# EAGLE design LPTSV2_usingATmega328PV6 (EAGLE 8.4.0)
AUTHOR: K. Townsend

## Sheet 1 of 3

## Sheet 2 of 3
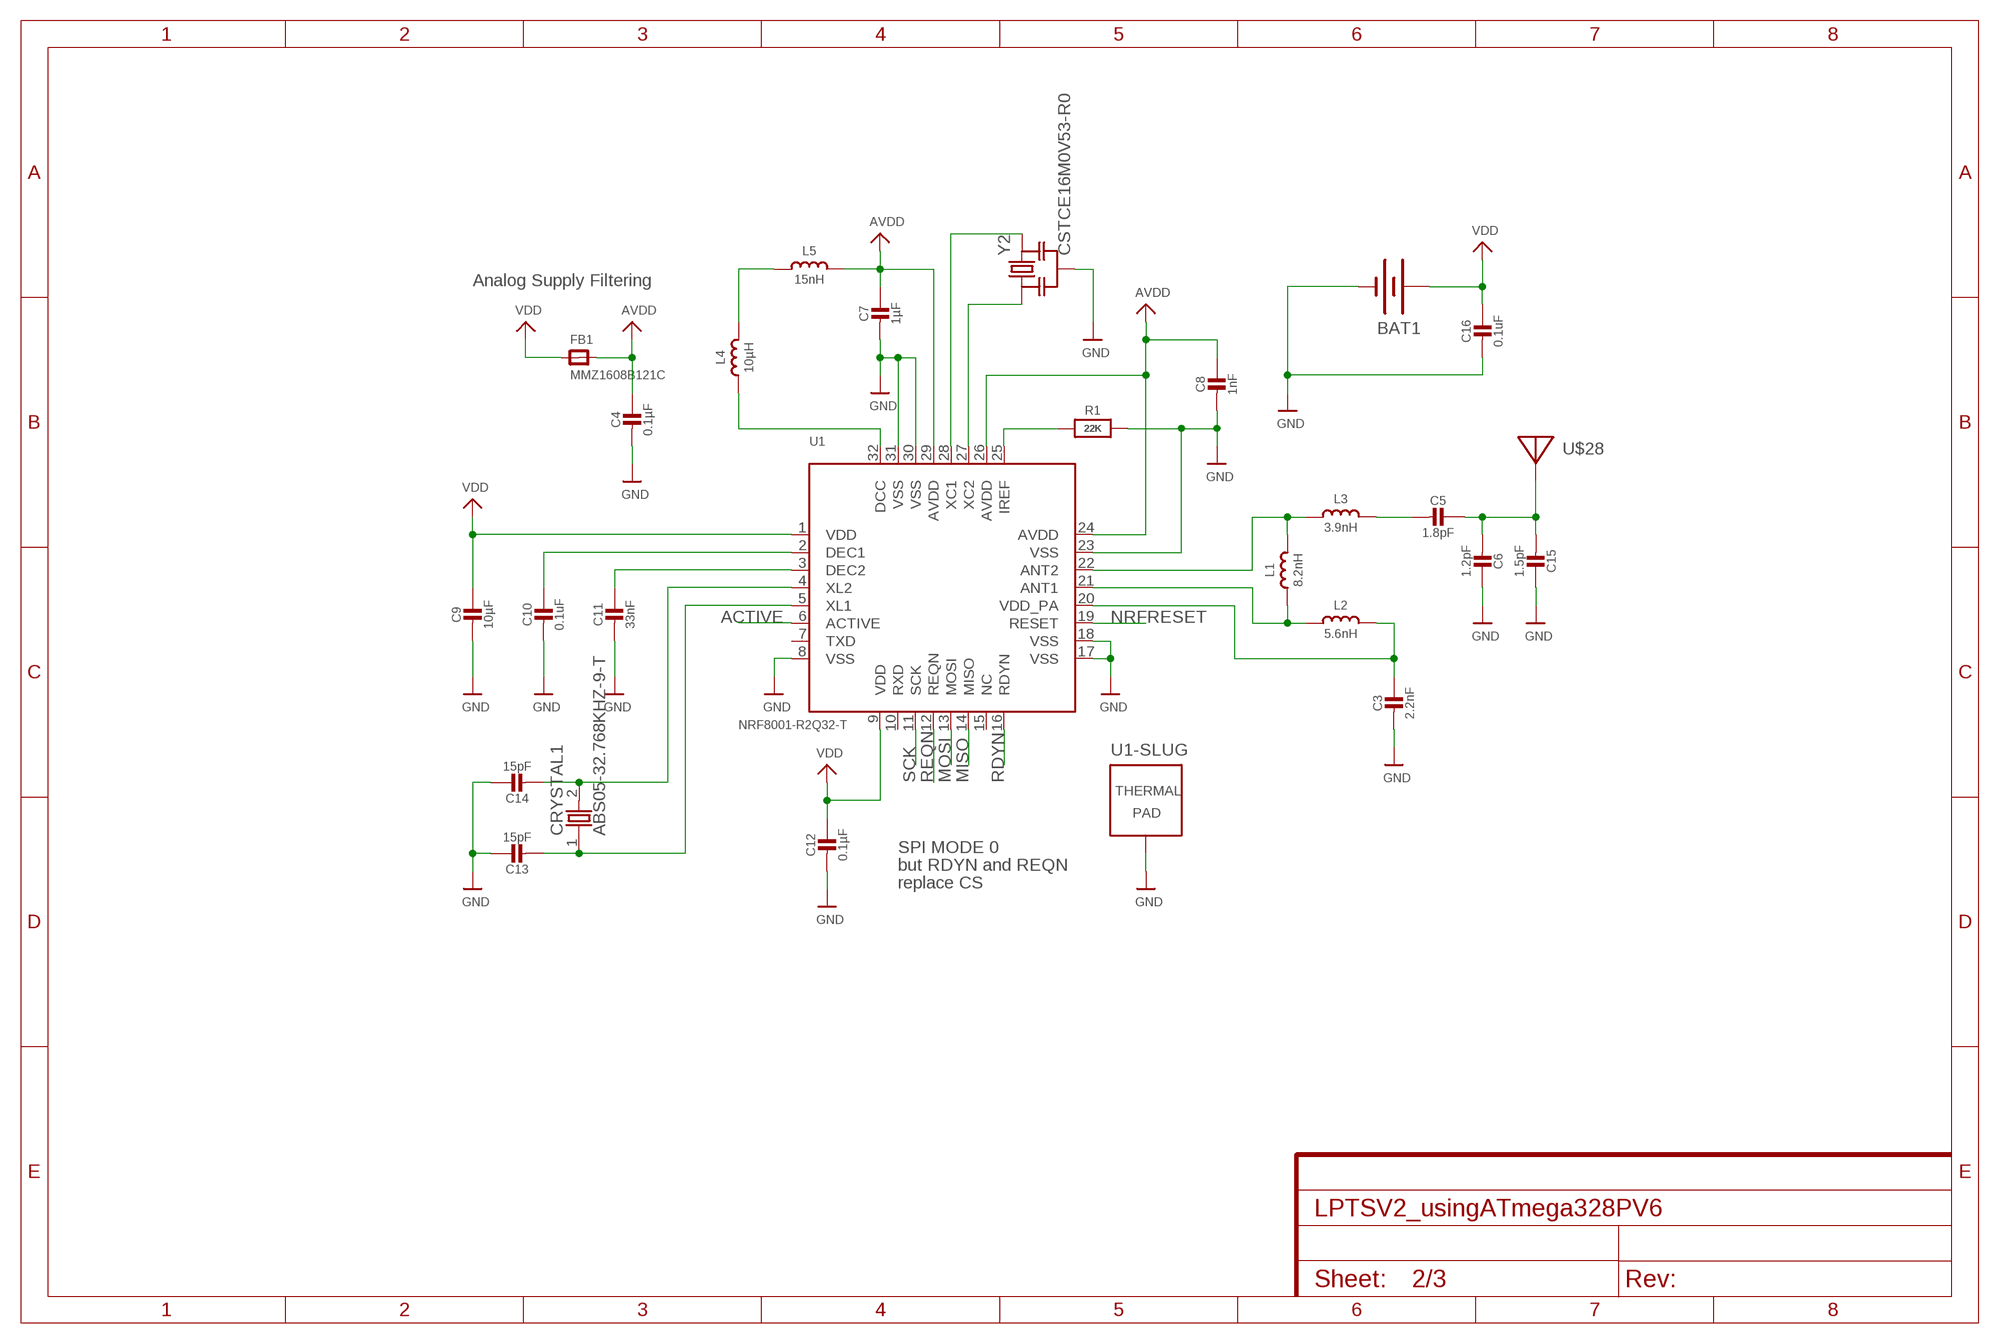
[diagram p0: schematic, sheet 2]

### Parts
BAT1  LINX-BAT-HLD-00120SMD  [BATTCON_20MM]
C3  2.2nF  CAP_CERAMIC_0402  [_0402]
C4  0.1µF  CAP_CERAMIC_0402  [_0402]
C5  1.8pF  CAP_CERAMIC_0402MP  [_0402MP]
C6  1.2pF  CAP_CERAMIC_0402MP  [_0402MP]
C7  1µF  CAP_CERAMIC_0402  [_0402]
C8  1nF  CAP_CERAMIC_0402  [_0402]
C9  10µF  CAP_CERAMIC_0402  [_0402]
C10  0.1uF  CAP_CERAMIC_0402  [_0402]
C11  33nF  CAP_CERAMIC_0402  [_0402]
C12  0.1µF  CAP_CERAMIC_0402  [_0402]
C13  15pF  CAP_CERAMIC_0402  [_0402]
C14  15pF  CAP_CERAMIC_0402  [_0402]
C15  1.5pF  CAP_CERAMIC_0402MP  [_0402MP]
C16  0.1uF  CAP_CERAMIC_0402  [_0402]
CRYSTAL1  ABS05-32.768KHZ-9-T  CRYSTAL2PIN  [CRYSTAL-2PIN]
FB1  MMZ1608B121C  FERRITE0805  [0805]
L1  8.2nH  INDUCTOR_0402  [_0402]
L2  5.6nH  INDUCTOR_0402  [_0402]
L3  3.9nH  INDUCTOR_0402  [_0402]
L4  10µH  INDUCTOR_0603  [_0603]
L5  15nH  INDUCTOR_0603  [_0603]
R1  22K  RESISTOR_0805  [_0805]
U1  NRF8001-R2Q32-T  MICROBUILDER_NRF8001  [MICROBUILDER_QFN32_5MM]
U$28  ANTENNA_PCBNRF8001_1.6MM  [ANT_PCB_2.4GHZ_NRF8001_1.6MM_1OZ]
Y2  CSTCE16M0V53-R0  RESONATOR-MURATACST_CE  [RESONATOR_MURATA2]

### Nets
ACTIVE: U1.6(ACTIVE)
AVDD: C4.1 C7.1 C8.1 FB1.2 L5.2 U1.24(AVDD) U1.26(AVDD) U1.29(AVDD)
GND: BAT1.2(-) C3.2 C4.2 C6.1 C7.2 C8.2 C9.2 C10.2 C11.2 C12.2 C13.1 C14.1 C15.1 C16.2 R1.2 U1.8(VSS) U1.17(VSS) U1.18(VSS) U1.23(VSS) U1.30(VSS) U1.31(VSS) U1.33(TP) Y2.2 ; also sheet 3
MISO: U1.14(MISO) ; also sheet 3
MOSI: U1.13(MOSI) ; also sheet 3
N$2: L1.2 L3.1 U1.22(ANT2)
N$3: L1.1 L2.1 U1.21(ANT1)
N$4: C3.1 L2.2 U1.20(VDD_PA)
N$5: L4.2 L5.1
N$6: C5.2 L3.2
N$7: C11.1 U1.3(DEC2)
N$8: C10.1 U1.2(DEC1)
N$9: U1.28(XC1) Y2.3
N$10: U1.27(XC2) Y2.1
N$11: L4.1 U1.32(DCC)
N$12: R1.1 U1.25(IREF)
N$13: C5.1 C6.2 C15.2 U$28.FEED
N$22: C14.2 CRYSTAL1.2 U1.4(XL2)
N$23: C13.2 CRYSTAL1.1 U1.5(XL1)
NRFRESET: U1.19(RESET) ; also sheet 3
RDYN: U1.16(RDYN) ; also sheet 3
REQN: U1.12(REQN) ; also sheet 3
SCK: U1.11(SCK) ; also sheet 3
VDD: BAT1.1(+) BAT1.3(+) C9.1 C12.1 C16.1 FB1.1 U1.1(VDD) U1.9(VDD) ; also sheet 3
Unconnected: U1.7(TXD) U1.10(RXD) U1.15(NC)

### Notes on the sheet
- Analog Supply Filtering
- SPI MODE 0
- but RDYN and REQN
- replace CS

## Sheet 3 of 3
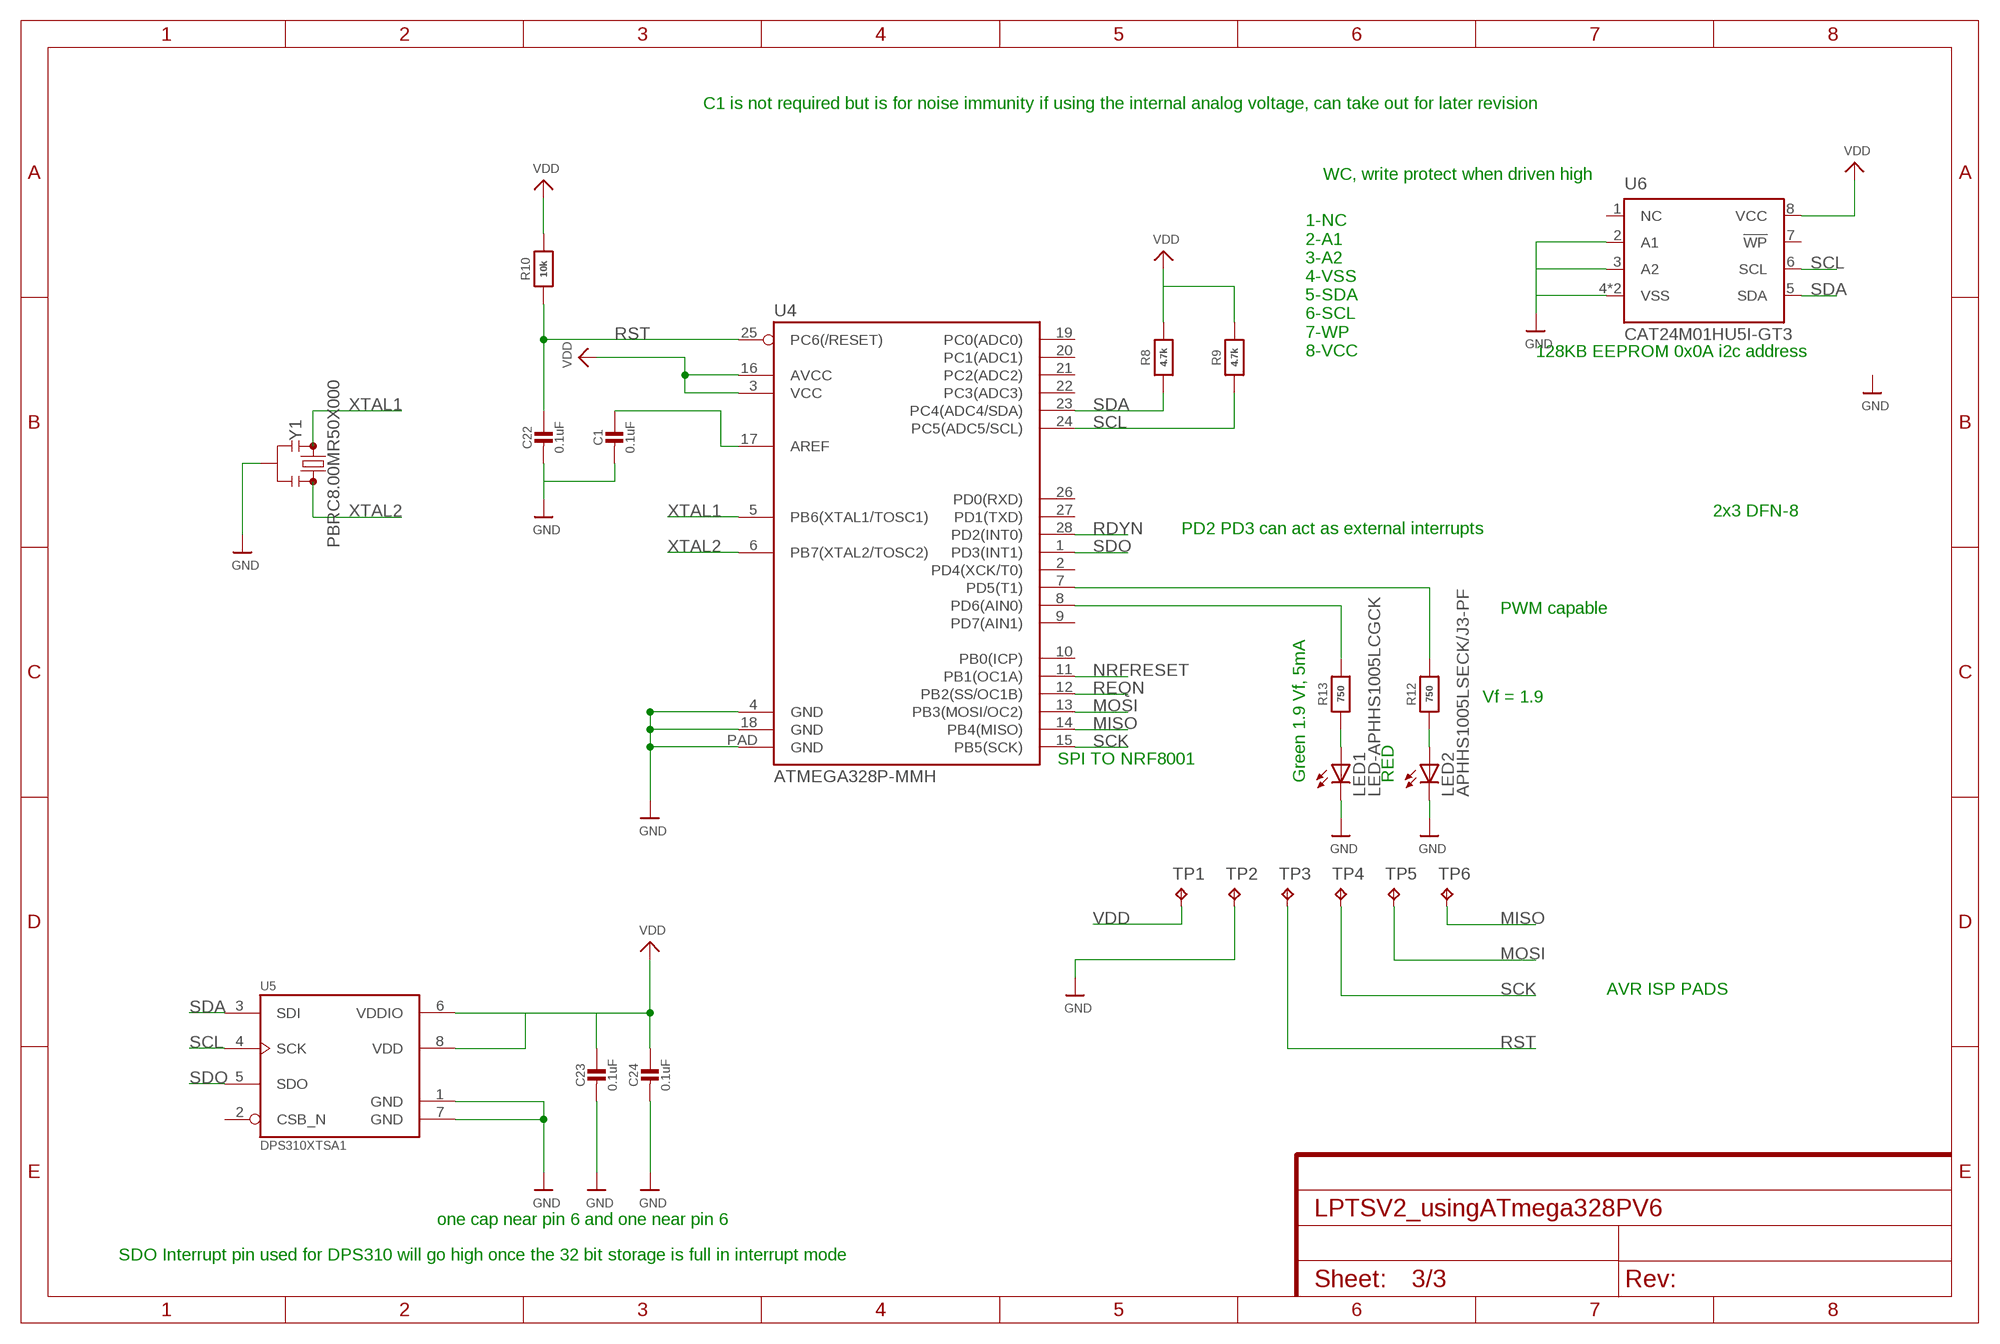
[diagram p1: schematic, sheet 3]

### Parts
C1  0.1uF  CAP_CERAMIC_0402  [_0402]
C22  0.1uF  CAP_CERAMIC_0402  [_0402]
C23  0.1uF  CAP_CERAMIC_0402  [_0402]
C24  0.1uF  CAP_CERAMIC_0402  [_0402]
LED1  LED-APHHS1005LCGCK  LED-0402  [0402-LED]
LED2  APHHS1005LSECK/J3-PF  LED-0402  [0402-LED]
R8  4.7k  RESISTOR_0402  [_0402]
R9  4.7k  RESISTOR_0402  [_0402]
R10  10k  RESISTOR_0402  [_0402]
R12  750  RESISTOR_0402  [_0402]
R13  750  RESISTOR_0402  [_0402]
TP1  TPTP10SQ  [TP10SQ]
TP2  TPTP10SQ  [TP10SQ]
TP3  TPTP10SQ  [TP10SQ]
TP4  TPTP10SQ  [TP10SQ]
TP5  TPTP10SQ  [TP10SQ]
TP6  TPTP10SQ  [TP10SQ]
U4  ATMEGA328P-MMH  SPARKFUN-IC-MICROCONTROLLER_ATMEGA328P_VQFNVQFN  [SPARKFUN-IC-MICROCONTROLLER_VQFN-28]
U5  DPS310XTSA1  DPS310  [LGA8S145X65P2X4_200X250X100]
U6  CAT24M01HU5I-GT3  [DFN-2X3]
Y1  PBRC8.00MR50X000  RESONATOR-4MHZSMD-4.5X2  [RESONATOR-SMD-4.5X2.0]

### Nets
GND: C1.2 C22.2 C23.2 C24.2 LED1.C LED2.C TP2.TP U4.4(GND) U4.18(GND) U4.PAD(GND) U5.1(GND) U5.7(GND) U6.2(A1) U6.3(A2) U6.4(VSS) U6.EXP(VSS) Y1.2 ; also sheet 2
MISO: TP6.TP U4.14(PB4(MISO)) ; also sheet 2
MOSI: TP5.TP U4.13(PB3(MOSI/OC2)) ; also sheet 2
N$1: R12.2 U4.7(PD5(T1))
N$14: R13.2 U4.8(PD6(AIN0))
N$15: LED1.A R13.1
N$16: LED2.A R12.1
N$18: C1.1 U4.17(AREF)
NRFRESET: U4.11(PB1(OC1A)) ; also sheet 2
RDYN: U4.28(PD2(INT0)) ; also sheet 2
REQN: U4.12(PB2(SS/OC1B)) ; also sheet 2
RST: C22.1 R10.1 TP3.TP U4.25(PC6(/RESET))
SCK: TP4.TP U4.15(PB5(SCK)) ; also sheet 2
SCL: R9.1 U4.24(PC5(ADC5/SCL)) U5.4(SCK) U6.6(SCL)
SDA: R8.1 U4.23(PC4(ADC4/SDA)) U5.3(SDI) U6.5(SDA)
SDO: U4.1(PD3(INT1)) U5.5(SDO)
VDD: C23.1 C24.1 R8.2 R9.2 R10.2 TP1.TP U4.3(VCC) U4.16(AVCC) U5.6(VDDIO) U5.8(VDD) U6.8(VCC) ; also sheet 2
XTAL1: U4.5(PB6(XTAL1/TOSC1)) Y1.1
XTAL2: U4.6(PB7(XTAL2/TOSC2)) Y1.3
Unconnected: U4.2(PD4(XCK/T0)) U4.9(PD7(AIN1)) U4.10(PB0(ICP)) U4.19(PC0(ADC0)) U4.20(PC1(ADC1)) U4.21(PC2(ADC2)) U4.22(PC3(ADC3)) U4.26(PD0(RXD)) U4.27(PD1(TXD)) U5.2(CSB_N) U6.1(NC) U6.7(!WP)

### Notes on the sheet
- C1 is not required but is for noise immunity if using the internal analog voltage, can take out for later revision
- WC, write protect when driven high
- 128KB EEPROM 0x0A i2c address
- 1-NC
  2-A1
  3-A2
  4-VSS
  5-SDA
  6-SCL
  7-WP
  8-VCC
- 2x3 DFN-8
- PD2 PD3 can act as external interrupts
- PWM capable
- Vf = 1.9
- SPI TO NRF8001
- Green 1.9 Vf, 5mA | RED
- AVR ISP PADS
- one cap near pin 6 and one near pin 6
- SDO Interrupt pin used for DPS310 will go high once the 32 bit storage is full in interrupt mode

## Library data of the parts
BAT1 = battery (1):LINX-BAT-HLD-001: Battery Holders Linxtechnologies CR2032 battery holder: http://www.linxtechnologies.com/resources/diagrams/bat-hld-001.pdf; PARTNUMBER: BAT-HLD-001-TRCT-ND
C1 C4 C10 C12 C16 C22-C24 = microbuilder:CAP_CERAMIC: Ceramic Capacitors For new designs, use the packages preceded by an '_' character since they are more reliable: The following footprints should be used on most boards: _0402 - Standard footprint for regular board layouts _0603 - Standard footprint for regular board layouts _0805 - Standard footprint for regular board layouts _1206 - Standard footprint for regular board layouts For extremely tight-pitch boards where space is at a premium, the following 'micro-pitch' footprints can be used (smaller pads, no silkscreen outline, etc.): _0402MP - Micro-pitch footprint for very dense/compact boards _0603MP - Micro-pitch footprint for very dense/compact boards _0805MP - Micro-pitch footprint for very dense/compact boards _1206MP - Micro-pitch footprint for very dense/compact boards; PARTNUMBER: GRM155R71C104KA88J
C3 = microbuilder:CAP_CERAMIC: Ceramic Capacitors For new designs, use the packages preceded by an '_' character since they are more reliable: The following footprints should be used on most boards: _0402 - Standard footprint for regular board layouts _0603 - Standard footprint for regular board layouts _0805 - Standard footprint for regular board layouts _1206 - Standard footprint for regular board layouts For extremely tight-pitch boards where space is at a premium, the following 'micro-pitch' footprints can be used (smaller pads, no silkscreen outline, etc.): _0402MP - Micro-pitch footprint for very dense/compact boards _0603MP - Micro-pitch footprint for very dense/compact boards _0805MP - Micro-pitch footprint for very dense/compact boards _1206MP - Micro-pitch footprint for very dense/compact boards; PARTNUMBER: C0402C222J8JAC7867
C5 = microbuilder:CAP_CERAMIC: Ceramic Capacitors For new designs, use the packages preceded by an '_' character since they are more reliable: The following footprints should be used on most boards: _0402 - Standard footprint for regular board layouts _0603 - Standard footprint for regular board layouts _0805 - Standard footprint for regular board layouts _1206 - Standard footprint for regular board layouts For extremely tight-pitch boards where space is at a premium, the following 'micro-pitch' footprints can be used (smaller pads, no silkscreen outline, etc.): _0402MP - Micro-pitch footprint for very dense/compact boards _0603MP - Micro-pitch footprint for very dense/compact boards _0805MP - Micro-pitch footprint for very dense/compact boards _1206MP - Micro-pitch footprint for very dense/compact boards; PARTNUMBER: GRM1555C1E1R8BA01D
C6 = microbuilder:CAP_CERAMIC: Ceramic Capacitors For new designs, use the packages preceded by an '_' character since they are more reliable: The following footprints should be used on most boards: _0402 - Standard footprint for regular board layouts _0603 - Standard footprint for regular board layouts _0805 - Standard footprint for regular board layouts _1206 - Standard footprint for regular board layouts For extremely tight-pitch boards where space is at a premium, the following 'micro-pitch' footprints can be used (smaller pads, no silkscreen outline, etc.): _0402MP - Micro-pitch footprint for very dense/compact boards _0603MP - Micro-pitch footprint for very dense/compact boards _0805MP - Micro-pitch footprint for very dense/compact boards _1206MP - Micro-pitch footprint for very dense/compact boards; PARTNUMBER: GRM1555C1E1R2BA01D
C7 = microbuilder:CAP_CERAMIC: Ceramic Capacitors For new designs, use the packages preceded by an '_' character since they are more reliable: The following footprints should be used on most boards: _0402 - Standard footprint for regular board layouts _0603 - Standard footprint for regular board layouts _0805 - Standard footprint for regular board layouts _1206 - Standard footprint for regular board layouts For extremely tight-pitch boards where space is at a premium, the following 'micro-pitch' footprints can be used (smaller pads, no silkscreen outline, etc.): _0402MP - Micro-pitch footprint for very dense/compact boards _0603MP - Micro-pitch footprint for very dense/compact boards _0805MP - Micro-pitch footprint for very dense/compact boards _1206MP - Micro-pitch footprint for very dense/compact boards; PARTNUMBER: 0402ZD105KAT2A
C8 = microbuilder:CAP_CERAMIC: Ceramic Capacitors For new designs, use the packages preceded by an '_' character since they are more reliable: The following footprints should be used on most boards: _0402 - Standard footprint for regular board layouts _0603 - Standard footprint for regular board layouts _0805 - Standard footprint for regular board layouts _1206 - Standard footprint for regular board layouts For extremely tight-pitch boards where space is at a premium, the following 'micro-pitch' footprints can be used (smaller pads, no silkscreen outline, etc.): _0402MP - Micro-pitch footprint for very dense/compact boards _0603MP - Micro-pitch footprint for very dense/compact boards _0805MP - Micro-pitch footprint for very dense/compact boards _1206MP - Micro-pitch footprint for very dense/compact boards; PARTNUMBER: GRM155R71H102KA01D
C9 = microbuilder:CAP_CERAMIC: Ceramic Capacitors For new designs, use the packages preceded by an '_' character since they are more reliable: The following footprints should be used on most boards: _0402 - Standard footprint for regular board layouts _0603 - Standard footprint for regular board layouts _0805 - Standard footprint for regular board layouts _1206 - Standard footprint for regular board layouts For extremely tight-pitch boards where space is at a premium, the following 'micro-pitch' footprints can be used (smaller pads, no silkscreen outline, etc.): _0402MP - Micro-pitch footprint for very dense/compact boards _0603MP - Micro-pitch footprint for very dense/compact boards _0805MP - Micro-pitch footprint for very dense/compact boards _1206MP - Micro-pitch footprint for very dense/compact boards; PARTNUMBER: GRM155R60J106ME15D
C11 = microbuilder:CAP_CERAMIC: Ceramic Capacitors For new designs, use the packages preceded by an '_' character since they are more reliable: The following footprints should be used on most boards: _0402 - Standard footprint for regular board layouts _0603 - Standard footprint for regular board layouts _0805 - Standard footprint for regular board layouts _1206 - Standard footprint for regular board layouts For extremely tight-pitch boards where space is at a premium, the following 'micro-pitch' footprints can be used (smaller pads, no silkscreen outline, etc.): _0402MP - Micro-pitch footprint for very dense/compact boards _0603MP - Micro-pitch footprint for very dense/compact boards _0805MP - Micro-pitch footprint for very dense/compact boards _1206MP - Micro-pitch footprint for very dense/compact boards; PARTNUMBER: C0402C333K8RACTU
C13 C14 = microbuilder:CAP_CERAMIC: Ceramic Capacitors For new designs, use the packages preceded by an '_' character since they are more reliable: The following footprints should be used on most boards: _0402 - Standard footprint for regular board layouts _0603 - Standard footprint for regular board layouts _0805 - Standard footprint for regular board layouts _1206 - Standard footprint for regular board layouts For extremely tight-pitch boards where space is at a premium, the following 'micro-pitch' footprints can be used (smaller pads, no silkscreen outline, etc.): _0402MP - Micro-pitch footprint for very dense/compact boards _0603MP - Micro-pitch footprint for very dense/compact boards _0805MP - Micro-pitch footprint for very dense/compact boards _1206MP - Micro-pitch footprint for very dense/compact boards; PARTNUMBER: GRM1555C1H150JA01D
C15 = microbuilder:CAP_CERAMIC: Ceramic Capacitors For new designs, use the packages preceded by an '_' character since they are more reliable: The following footprints should be used on most boards: _0402 - Standard footprint for regular board layouts _0603 - Standard footprint for regular board layouts _0805 - Standard footprint for regular board layouts _1206 - Standard footprint for regular board layouts For extremely tight-pitch boards where space is at a premium, the following 'micro-pitch' footprints can be used (smaller pads, no silkscreen outline, etc.): _0402MP - Micro-pitch footprint for very dense/compact boards _0603MP - Micro-pitch footprint for very dense/compact boards _0805MP - Micro-pitch footprint for very dense/compact boards _1206MP - Micro-pitch footprint for very dense/compact boards; PARTNUMBER: GRM1555C1H1R5BA01D
CRYSTAL1 = Crystal-ABS05-32.768KHZ-9-T:CRYSTAL: SMD LOW PROFILE CRYSTAL 1.6 x 1.0 x 0.5mm http://www.digikey.com/product-detail/en/ABS05-32.768KHZ-9-T/535-11897-1-ND/35080692
FB1 = microbuilder:FERRITE: Ferrite Bead 0603 MMZ1608B121C - 120 Ohm @ 100MHz, 600mA, 0.15 Ohm DC Resistance - Digikey: 445-2164-1-ND BK1608HW121-T - 120 Ohm, 600mA Ferrite Chip - Digikey: 587-1876-2-ND 0805 HZ0805B272R-10 - 2.7K Ohm @ 100MHz, 200mA, 0.8 Ohm DC Resistance - Digikey: 240-2504-1-ND (see also Murata BLM21BD272SN1L) MMZ2012Y152B - 1.5K Ohm @ 100MHz, 500mA, 0.4 Ohm DC Resistance - Digikey: 445-1560-1-ND - Mainly for high frequency (80-400MHz) MMZ2012R102A - 1K Ohm @ 100MHz, 500mA, 0.3 Ohm DC Resistance - Digikey: 445-1555-2-ND - More general purpose (10-200MHz); PARTNUMBER: MMZ1608B121CTDH5
L1 = microbuilder:INDUCTOR: Inductors 0603: 10nH Ceramic Inductor - microwire antenna/RF (Digikey: 712-1434-2-ND) 0805: 560nH Ceramic Inductor - RF (Digikey: 553-1047-1-ND) 270nH Ceramic Inductor - Q = 40@250MHz, +-5%, 1 Ohm DC Resistance (Digikey: 535-10506-2-ND) 1007 (2518 Metric) SMT: 10µH 10% 250mOhm 820mA 1007 Inductor (Digikey: 587-2189-1-ND) 22µH 10% 500mOhm 580mA 1007 Inductor (Digikey: 587-2190-1-ND) 47µH 10% 950mOhm 420mA 1007 Inductor (Digikey: 587-2191-1-ND) 47µH 5% 100mOhm 1A 1008 Inductor (Digikey: 732-1816-1-ND) 5.0x5.0mm (Taiyo Yuden NR5040 Series) 6.8µH 20% 2.3A 64mOhm Inductor (Digikey: 587-2374-2-ND) 5.0x5.0mm (TDK VLC5045 Series) 4.7µH 20% 3.3A 34mOhm Inductor (Digikey: 445-6526-1-ND) 6.8µH 20% 2.7A 46mOhm Inductor (Digikey: 445-6527-1-ND) 6.0x6.0mm (TDK VLC6045 Series) 4.7µH 20% 3.8A 27mOhm Inductor (Digikey: 445-6538-2-ND) 6.8µH 20% 3A 41mOhm Inductor (Digikey: 445-6540-1-ND) 6.2µH 30% 2.2A 45mOhm Inductor (Digikey: SRR5028-6R2YCT-ND) - Not TDK VLC6045 but footprint should match 6.0x6.0mm (TDK SLF6045 Series) 6.8uH 30% 2A 33mOhm Inductor (Digikey: 445-4572-1-ND, Mouser: 810-SLF645T6R8N2R0PF) 6.0x6.0mm (Sumida CDRH5D28 Series) 6.2uH 30% 1.8A 45mOhm Inductor (Digikey: 308-1542-1-ND) Taiyo Yuden NR3015T2R2M - 2.2uH 20% 1.5A (Digikey: 587-1648-2-ND, Mouser: 963-NR3015T2R2M) - Used with TI TPS62172 CoilCraft RFID Transponder Coil - MA5532-AE (For use with AS3935 Lightning Sensor); PARTNUMBER: LQP15MN8N2B02D
L2 = microbuilder:INDUCTOR: Inductors 0603: 10nH Ceramic Inductor - microwire antenna/RF (Digikey: 712-1434-2-ND) 0805: 560nH Ceramic Inductor - RF (Digikey: 553-1047-1-ND) 270nH Ceramic Inductor - Q = 40@250MHz, +-5%, 1 Ohm DC Resistance (Digikey: 535-10506-2-ND) 1007 (2518 Metric) SMT: 10µH 10% 250mOhm 820mA 1007 Inductor (Digikey: 587-2189-1-ND) 22µH 10% 500mOhm 580mA 1007 Inductor (Digikey: 587-2190-1-ND) 47µH 10% 950mOhm 420mA 1007 Inductor (Digikey: 587-2191-1-ND) 47µH 5% 100mOhm 1A 1008 Inductor (Digikey: 732-1816-1-ND) 5.0x5.0mm (Taiyo Yuden NR5040 Series) 6.8µH 20% 2.3A 64mOhm Inductor (Digikey: 587-2374-2-ND) 5.0x5.0mm (TDK VLC5045 Series) 4.7µH 20% 3.3A 34mOhm Inductor (Digikey: 445-6526-1-ND) 6.8µH 20% 2.7A 46mOhm Inductor (Digikey: 445-6527-1-ND) 6.0x6.0mm (TDK VLC6045 Series) 4.7µH 20% 3.8A 27mOhm Inductor (Digikey: 445-6538-2-ND) 6.8µH 20% 3A 41mOhm Inductor (Digikey: 445-6540-1-ND) 6.2µH 30% 2.2A 45mOhm Inductor (Digikey: SRR5028-6R2YCT-ND) - Not TDK VLC6045 but footprint should match 6.0x6.0mm (TDK SLF6045 Series) 6.8uH 30% 2A 33mOhm Inductor (Digikey: 445-4572-1-ND, Mouser: 810-SLF645T6R8N2R0PF) 6.0x6.0mm (Sumida CDRH5D28 Series) 6.2uH 30% 1.8A 45mOhm Inductor (Digikey: 308-1542-1-ND) Taiyo Yuden NR3015T2R2M - 2.2uH 20% 1.5A (Digikey: 587-1648-2-ND, Mouser: 963-NR3015T2R2M) - Used with TI TPS62172 CoilCraft RFID Transponder Coil - MA5532-AE (For use with AS3935 Lightning Sensor); PARTNUMBER: LQP15MN5N6B02D
L3 = microbuilder:INDUCTOR: Inductors 0603: 10nH Ceramic Inductor - microwire antenna/RF (Digikey: 712-1434-2-ND) 0805: 560nH Ceramic Inductor - RF (Digikey: 553-1047-1-ND) 270nH Ceramic Inductor - Q = 40@250MHz, +-5%, 1 Ohm DC Resistance (Digikey: 535-10506-2-ND) 1007 (2518 Metric) SMT: 10µH 10% 250mOhm 820mA 1007 Inductor (Digikey: 587-2189-1-ND) 22µH 10% 500mOhm 580mA 1007 Inductor (Digikey: 587-2190-1-ND) 47µH 10% 950mOhm 420mA 1007 Inductor (Digikey: 587-2191-1-ND) 47µH 5% 100mOhm 1A 1008 Inductor (Digikey: 732-1816-1-ND) 5.0x5.0mm (Taiyo Yuden NR5040 Series) 6.8µH 20% 2.3A 64mOhm Inductor (Digikey: 587-2374-2-ND) 5.0x5.0mm (TDK VLC5045 Series) 4.7µH 20% 3.3A 34mOhm Inductor (Digikey: 445-6526-1-ND) 6.8µH 20% 2.7A 46mOhm Inductor (Digikey: 445-6527-1-ND) 6.0x6.0mm (TDK VLC6045 Series) 4.7µH 20% 3.8A 27mOhm Inductor (Digikey: 445-6538-2-ND) 6.8µH 20% 3A 41mOhm Inductor (Digikey: 445-6540-1-ND) 6.2µH 30% 2.2A 45mOhm Inductor (Digikey: SRR5028-6R2YCT-ND) - Not TDK VLC6045 but footprint should match 6.0x6.0mm (TDK SLF6045 Series) 6.8uH 30% 2A 33mOhm Inductor (Digikey: 445-4572-1-ND, Mouser: 810-SLF645T6R8N2R0PF) 6.0x6.0mm (Sumida CDRH5D28 Series) 6.2uH 30% 1.8A 45mOhm Inductor (Digikey: 308-1542-1-ND) Taiyo Yuden NR3015T2R2M - 2.2uH 20% 1.5A (Digikey: 587-1648-2-ND, Mouser: 963-NR3015T2R2M) - Used with TI TPS62172 CoilCraft RFID Transponder Coil - MA5532-AE (For use with AS3935 Lightning Sensor); PARTNUMBER: LQP03TN3N9B02D
L4 = microbuilder:INDUCTOR: Inductors 0603: 10nH Ceramic Inductor - microwire antenna/RF (Digikey: 712-1434-2-ND) 0805: 560nH Ceramic Inductor - RF (Digikey: 553-1047-1-ND) 270nH Ceramic Inductor - Q = 40@250MHz, +-5%, 1 Ohm DC Resistance (Digikey: 535-10506-2-ND) 1007 (2518 Metric) SMT: 10µH 10% 250mOhm 820mA 1007 Inductor (Digikey: 587-2189-1-ND) 22µH 10% 500mOhm 580mA 1007 Inductor (Digikey: 587-2190-1-ND) 47µH 10% 950mOhm 420mA 1007 Inductor (Digikey: 587-2191-1-ND) 47µH 5% 100mOhm 1A 1008 Inductor (Digikey: 732-1816-1-ND) 5.0x5.0mm (Taiyo Yuden NR5040 Series) 6.8µH 20% 2.3A 64mOhm Inductor (Digikey: 587-2374-2-ND) 5.0x5.0mm (TDK VLC5045 Series) 4.7µH 20% 3.3A 34mOhm Inductor (Digikey: 445-6526-1-ND) 6.8µH 20% 2.7A 46mOhm Inductor (Digikey: 445-6527-1-ND) 6.0x6.0mm (TDK VLC6045 Series) 4.7µH 20% 3.8A 27mOhm Inductor (Digikey: 445-6538-2-ND) 6.8µH 20% 3A 41mOhm Inductor (Digikey: 445-6540-1-ND) 6.2µH 30% 2.2A 45mOhm Inductor (Digikey: SRR5028-6R2YCT-ND) - Not TDK VLC6045 but footprint should match 6.0x6.0mm (TDK SLF6045 Series) 6.8uH 30% 2A 33mOhm Inductor (Digikey: 445-4572-1-ND, Mouser: 810-SLF645T6R8N2R0PF) 6.0x6.0mm (Sumida CDRH5D28 Series) 6.2uH 30% 1.8A 45mOhm Inductor (Digikey: 308-1542-1-ND) Taiyo Yuden NR3015T2R2M - 2.2uH 20% 1.5A (Digikey: 587-1648-2-ND, Mouser: 963-NR3015T2R2M) - Used with TI TPS62172 CoilCraft RFID Transponder Coil - MA5532-AE (For use with AS3935 Lightning Sensor); PARTNUMBER: LBMF1608T100K
L5 = microbuilder:INDUCTOR: Inductors 0603: 10nH Ceramic Inductor - microwire antenna/RF (Digikey: 712-1434-2-ND) 0805: 560nH Ceramic Inductor - RF (Digikey: 553-1047-1-ND) 270nH Ceramic Inductor - Q = 40@250MHz, +-5%, 1 Ohm DC Resistance (Digikey: 535-10506-2-ND) 1007 (2518 Metric) SMT: 10µH 10% 250mOhm 820mA 1007 Inductor (Digikey: 587-2189-1-ND) 22µH 10% 500mOhm 580mA 1007 Inductor (Digikey: 587-2190-1-ND) 47µH 10% 950mOhm 420mA 1007 Inductor (Digikey: 587-2191-1-ND) 47µH 5% 100mOhm 1A 1008 Inductor (Digikey: 732-1816-1-ND) 5.0x5.0mm (Taiyo Yuden NR5040 Series) 6.8µH 20% 2.3A 64mOhm Inductor (Digikey: 587-2374-2-ND) 5.0x5.0mm (TDK VLC5045 Series) 4.7µH 20% 3.3A 34mOhm Inductor (Digikey: 445-6526-1-ND) 6.8µH 20% 2.7A 46mOhm Inductor (Digikey: 445-6527-1-ND) 6.0x6.0mm (TDK VLC6045 Series) 4.7µH 20% 3.8A 27mOhm Inductor (Digikey: 445-6538-2-ND) 6.8µH 20% 3A 41mOhm Inductor (Digikey: 445-6540-1-ND) 6.2µH 30% 2.2A 45mOhm Inductor (Digikey: SRR5028-6R2YCT-ND) - Not TDK VLC6045 but footprint should match 6.0x6.0mm (TDK SLF6045 Series) 6.8uH 30% 2A 33mOhm Inductor (Digikey: 445-4572-1-ND, Mouser: 810-SLF645T6R8N2R0PF) 6.0x6.0mm (Sumida CDRH5D28 Series) 6.2uH 30% 1.8A 45mOhm Inductor (Digikey: 308-1542-1-ND) Taiyo Yuden NR3015T2R2M - 2.2uH 20% 1.5A (Digikey: 587-1648-2-ND, Mouser: 963-NR3015T2R2M) - Used with TI TPS62172 CoilCraft RFID Transponder Coil - MA5532-AE (For use with AS3935 Lightning Sensor); PARTNUMBER: L-14C15NJV4T
LED1 LED2 = pel_dipol_comp (2):LED
R1 = microbuilder:RESISTOR: Resistors For new designs, use the packages preceded by an '_' character since they are more reliable: The following footprints should be used on most boards: _0402 - Standard footprint for regular board layouts _0603 - Standard footprint for regular board layouts _0805 - Standard footprint for regular board layouts _1206 - Standard footprint for regular board layouts For extremely tight-pitch boards where space is at a premium, the following 'micro-pitch' footprints can be used (smaller pads, no silkscreen outline, etc.): _0402MP - Micro-pitch footprint for very dense/compact boards _0603MP - Micro-pitch footprint for very dense/compact boards _0805MP - Micro-pitch footprint for very dense/compact boards _1206MP - Micro-pitch footprint for very dense/compact boards; PARTNUMBER: RC0805JR-0722KL
R8 R9 = microbuilder:RESISTOR: Resistors For new designs, use the packages preceded by an '_' character since they are more reliable: The following footprints should be used on most boards: _0402 - Standard footprint for regular board layouts _0603 - Standard footprint for regular board layouts _0805 - Standard footprint for regular board layouts _1206 - Standard footprint for regular board layouts For extremely tight-pitch boards where space is at a premium, the following 'micro-pitch' footprints can be used (smaller pads, no silkscreen outline, etc.): _0402MP - Micro-pitch footprint for very dense/compact boards _0603MP - Micro-pitch footprint for very dense/compact boards _0805MP - Micro-pitch footprint for very dense/compact boards _1206MP - Micro-pitch footprint for very dense/compact boards; PARTNUMBER: RC0402JR-074K7L
R10 = microbuilder:RESISTOR: Resistors For new designs, use the packages preceded by an '_' character since they are more reliable: The following footprints should be used on most boards: _0402 - Standard footprint for regular board layouts _0603 - Standard footprint for regular board layouts _0805 - Standard footprint for regular board layouts _1206 - Standard footprint for regular board layouts For extremely tight-pitch boards where space is at a premium, the following 'micro-pitch' footprints can be used (smaller pads, no silkscreen outline, etc.): _0402MP - Micro-pitch footprint for very dense/compact boards _0603MP - Micro-pitch footprint for very dense/compact boards _0805MP - Micro-pitch footprint for very dense/compact boards _1206MP - Micro-pitch footprint for very dense/compact boards; PARTNUMBER: RC0402JR-0710KL
R12 R13 = microbuilder:RESISTOR: Resistors For new designs, use the packages preceded by an '_' character since they are more reliable: The following footprints should be used on most boards: _0402 - Standard footprint for regular board layouts _0603 - Standard footprint for regular board layouts _0805 - Standard footprint for regular board layouts _1206 - Standard footprint for regular board layouts For extremely tight-pitch boards where space is at a premium, the following 'micro-pitch' footprints can be used (smaller pads, no silkscreen outline, etc.): _0402MP - Micro-pitch footprint for very dense/compact boards _0603MP - Micro-pitch footprint for very dense/compact boards _0805MP - Micro-pitch footprint for very dense/compact boards _1206MP - Micro-pitch footprint for very dense/compact boards; PARTNUMBER: RC0402JR-07750RL
TP1-TP6 = testpad:TP: Test pad
U1 = LPTSV2_usingATmega328PV6:MICROBUILDER_NRF8001: nRF8001 - Bluetooth Low-Energy Transceiver VDD: 1.9-3.6V Temp: -40°C - 85°C
U4 = LPTSV2_usingATmega328PV6:SPARKFUN-IC-MICROCONTROLLER_ATMEGA328P_VQFN: Atmel 328P QFN part not in catalog
U5 = DPS310:DPS310: DPS310 Digital Barometric Pressure Sensor for Portable Devices LGA8S145X65P2X4_200X250X100
U6 = CAT24M01HU5I-GT3:CAT24M01HU5I-GT3: Datasheet: http://www.onsemi.com/pub/Collateral/CAT24M01-D.PDF Digikey part number: CAT24M01HU5I-GT3OSCT-ND UDFN-8 2x3
U$28 = microbuilder:ANTENNA_PCB: Various pre-calculated PCB Antennas NRF8001 1.6mm 1Oz - 2.4GHz PCB antenna for 1.6mm PCBs with 1oz copper, double-sided boards (no GND plan beneath antenna). See nRF2740 production files for further information and impedance matching network. 868MHz/2.4GHz DUALBAND - Dual 868MHz and 2.4GHz centered antenna based on board #6 of the CC-ANTENNA-DK from Chipcon/TI
Y1 = SparkFun-Clocks:RESONATOR-4MHZ: 4MHz Resonator Digikey Example <http://www.digikey.com/product-search/en?keywords=490-1200-1-ND> Frequency: 4MHz Frequency Stability: ±0.2% Frequency Tolerance: ±0.5% Capacitance: 15pF SparkFun Products SparkFun BadgerHack <https://www.sparkfun.com/products/13333>; PROD_ID: XTAL-12492; VALUE: 4MHz
Y2 = CSTCE16M0V53-R0:RESONATOR-MURATA: Murata ceramic Resonator "ceralock" CSTCE series with built in load capacitance +- 0.5% tolerance 12.51MHz to 19.99MHz 16MHz murata part#: CSTCE16M0V53-R0 16MHz digikey part#: 490-1198-1-ND $1.33 each

## Board
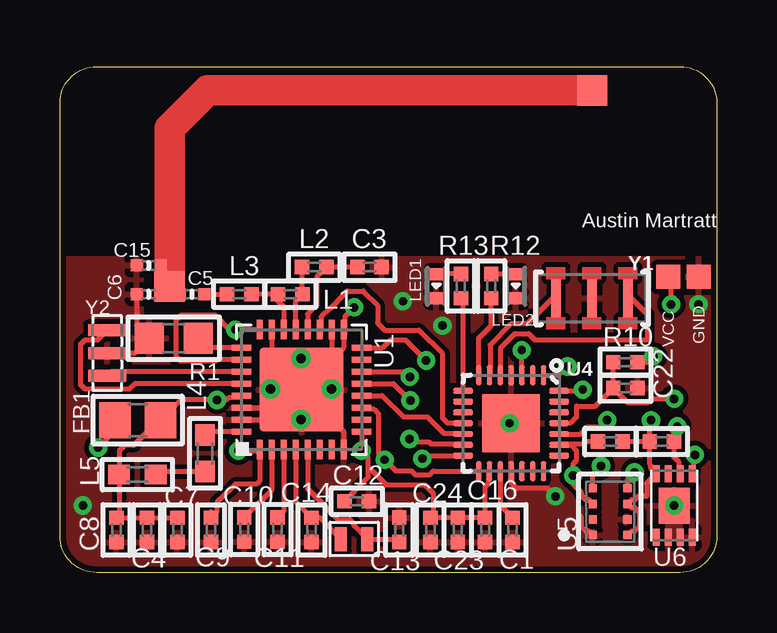
[diagram p2: board, top side]
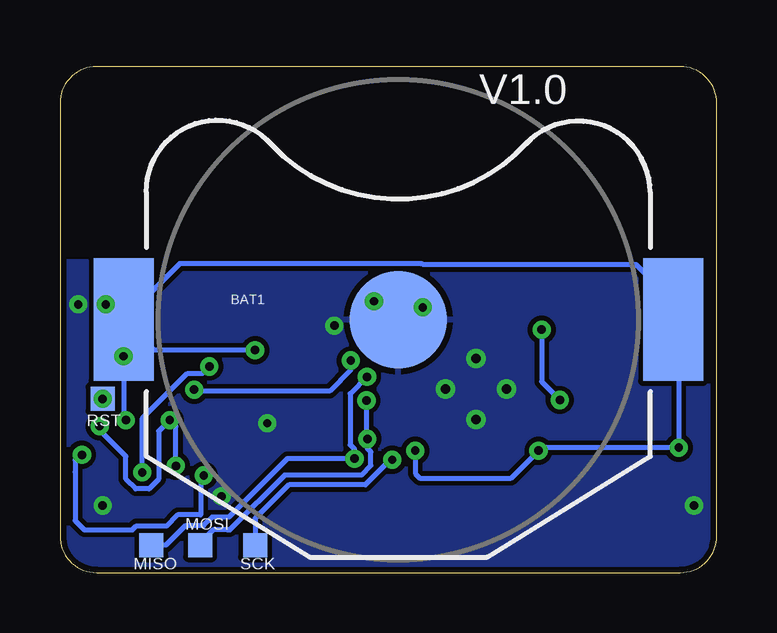
[diagram p3: board, bottom side, seen from below]

Size 27.37 x 21.08 mm. Coordinates in mm from the lower left corner, seen from the top.
Outline: 27.37,19.56 27.37,1.52 arc-90 25.84,0 1.52,0 arc-90 0,1.52 0,19.56 arc-90 1.52,21.08 25.84,21.08 arc-90 27.37,19.56
Copper layers (1*16): Top 0.035mm / dielectric 1.5mm / Bottom 0.035mm
Design rules "adafruit *": minimum track width 8mil, minimum drill 13mil, track to track 8mil, track to pad 8mil, pad to pad 8mil, via to via 8mil, smd to smd 0mil, copper to edge 10mil, drill to drill 8mil, minimum pad ring 10mil, minimum via ring 8mil, stop-mask expansion 2mil, vias tented up to drill 20mil, thermal gap 10mil
tRestrict: area 7.4,6.6 to 7.7,6.7

### Footprints (pad centres in the part's own frame; a part is rotated, then mirrored left to right if it is on the bottom)
BATTCON_20MM = smd 2.5 x 5.1: 1 -11.45,0; 3 11.45,0 | smd 4.064 x 4.064: 2 0,0
_0402 = smd 0.6 x 0.6: 1 -0.508,0; 2 0.508,0
_0402MP = smd 0.5 x 0.5: 1 -0.508,0; 2 0.508,0
CRYSTAL-2PIN = smd 0.5 x 1: 1 -0.55,0; 2 0.55,0
0805 = smd 1.3 x 1.5: 1 -0.95,0; 2 0.95,0
_0603 = smd 0.9 x 0.8: 1 -0.762,0; 2 0.762,0
0402-LED = smd 0.5 x 0.6: A 0.5,0; C -0.5,0
_0805 = smd 1.2 x 1.3: 1 -1.016,0; 2 1.016,0
TP10SQ = smd 1 x 1: TP 0,0
MICROBUILDER_QFN32_5MM = smd 0.8 x 0.25: 1 -2.5,1.75; 2 -2.5,1.25; 3 -2.5,0.75; 4 -2.5,0.25; 5 -2.5,-0.25; 6 -2.5,-0.75; 7 -2.5,-1.25; 8 -2.5,-1.75; 17 2.5,-1.75; 18 2.5,-1.25; 19 2.5,-0.75; 20 2.5,-0.25; 21 2.5,0.25; 22 2.5,0.75; 23 2.5,1.25; 24 2.5,1.75 | smd 0.25 x 0.8: 9 -1.75,-2.5; 10 -1.25,-2.5; 11 -0.75,-2.5; 12 -0.25,-2.5; 13 0.25,-2.5; 14 0.75,-2.5; 15 1.25,-2.5; 16 1.75,-2.5; 25 1.75,2.5; 26 1.25,2.5; 27 0.75,2.5; 28 0.25,2.5; 29 -0.25,2.5; 30 -0.75,2.5; 31 -1.25,2.5; 32 -1.75,2.5 | smd 3.5 x 3.5: 33 0,0
SPARKFUN-IC-MICROCONTROLLER_VQFN-28 = smd 0.82 x 0.24: 1 -2,1.35; 2 -2,0.9; 3 -2,0.45; 4 -2,0; 5 -2,-0.45; 6 -2,-0.9; 7 -2,-1.35; 15 2,-1.35; 16 2,-0.9; 17 2,-0.45; 18 2,0; 19 2,0.45; 20 2,0.9; 21 2,1.35 | smd 0.24 x 0.82: 8 -1.35,-2; 9 -0.9,-2; 10 -0.45,-2; 11 0,-2; 12 0.45,-2; 13 0.9,-2; 14 1.35,-2; 22 1.35,2; 23 0.9,2; 24 0.45,2; 25 0,2; 26 -0.45,2; 27 -0.9,2; 28 -1.35,2 | smd 2.4 x 2.4: PAD 0,0
LGA8S145X65P2X4_200X250X100 = smd 0.35 x 0.35: 1 -0.975,0.725; 2 -0.325,0.725; 3 0.325,0.725; 4 0.975,0.725; 5 0.975,-0.725; 6 0.325,-0.725; 7 -0.325,-0.725; 8 -0.975,-0.725
DFN-2X3 = smd 0.7 x 0.3: 1 -1.325,0.75; 2 -1.325,0.25; 3 -1.325,-0.25; 4 -1.325,-0.75; 5 1.325,-0.75; 6 1.325,-0.25; 7 1.325,0.25; 8 1.325,0.75 | smd 1.5 x 1.3: EXP 0,0
ANT_PCB_2.4GHZ_NRF8001_1.6MM_1OZ = smd 1.27 x 1.27: FEED 0,0; TESTPOINT -8.169,17.605
RESONATOR-SMD-4.5X2.0 = smd 0.4 x 1.6: 1 -1.5,0; 2 0,0; 3 1.5,0
RESONATOR_MURATA2 = smd 0.5 x 1.6: 1 -0.95,0; 2 0,0; 3 0.95,0

### Placement (x,y rotation side)
BAT1  13.27,10.54 0 bottom
C1  18.86,1.78 270 top
C3  12.9,12.73 0 top
C4  3.62,1.78 270 top
C5  5.5,11.6 0 top
C6  3.7,11.6 0 top
C7  4.89,1.78 270 top
C8  2.35,1.78 270 top
C9  6.29,1.78 270 top
C10  7.68,1.79 270 top
C11  9.07,1.79 270 top
C12  12.37,2.97 0 top
C13  14.13,1.78 270 top
C14  10.48,1.78 90 top
C15  3.7,12.8 0 top
C16  17.72,1.78 270 top
C22  23.56,7.68 0 top
C23  16.57,1.78 270 top
C24  15.43,1.78 270 top
CRYSTAL1  12.26,1.4 180 top
FB1  3.24,6.35 0 top
L1  9.6,11.6 180 top
L2  10.6,12.73 0 top
L3  7.47,11.6 180 top
L4  6.04,4.97 270 top
L5  3.23,4.08 180 top
LED1  15.68,11.94 90 top
LED2  18.99,11.94 90 top
R1  4.74,9.76 180 top
R8  22.92,5.46 0 top
R9  25.08,5.46 180 top
R10  23.56,8.76 0 top
R12  17.97,11.94 270 top
R13  16.7,11.94 270 top
TP1  25.34,12.32 0 top
TP2  26.61,12.32 90 top
TP3  25.59,7.24 180 bottom
TP4  19.24,1.14 0 bottom
TP5  21.53,1.14 180 bottom
TP6  23.56,1.14 180 bottom
U1  10.06,7.62 90 top
U4  18.8,6.22 270 top
U5  22.92,2.54 90 top
U6  25.59,2.79 90 top
U$28  4.57,11.92 270 top
Y1  22.16,11.43 180 top
Y2  1.97,9.14 90 top

### Tracks (layer width: path | path; a pad name or v marks a point on that pad's centre or on a via)
AVDD  (via drill 0.35)
  Top 0.203: U1.24 v7.3,10.12 7.08,10.12 6.48,10.72 5.03,10.72 4.85,10.54 4.85,8.99 5.03,8.81 6.48,8.81 6.55,8.87 U1.26 | C7.1 C4.1 C8.1 2.46,2.4 L5.2 2.48,4.1 2.48,5.08 2.69,5.29 3.06,5.29 4.12,6.35 FB1.2 5.03,7.19 v6.54,7.19 6.93,7.19 7.04,7.3 7.49,7.3 U1.29
  Bottom 0.203: v7.3,10.12 7.3,7.95 v6.54,7.19
GND  (via drill 0.35, 0.4)
  Top 0.203: U1.33 9.31,6.87 8.7,6.87 | U1.8 11.81,5.87 U1.33 | 11.81,9.91 11.81,9.37 U1.33 | 11.81,9.91 U1.17 | U1.18 11.31,7.69 11.36,7.65 | U1.30 8.7,6.87 | U1.31 8.62,6.37 8.7,6.3 8.7,6.87 | v12.26,11.05 11.87,10.67 11.87,9.97 11.81,9.91 | C6.1 3.19,10.3 R1.2 3.11,9.14 Y2.2 | U1.23 8.81,7.69 v8.77,7.65 | 21.72,2.35 21.72,1.91 21.9,1.74 22.03,1.74 U5.1 | v20.64,3.17 20.3,3.51 19.03,3.51 18.82,3.72 18.82,4.2 U4.18
  other vias: 10.04,6.38 11.31,7.65 14.29,11.3 18.73,6.22 0.95,2.79 10.04,8.92 26.61,11.18 15.94,10.29 25.59,2.79
  pour Top: 12.9,9.1 12.9,13.1 47.26,13.1 47.26,-27.84 -3.37,-28.48 -3.75,13.1 3.4,13.1 3.4,10.6 7.4,10.6 7.4,9.1
  pour Bottom: -2.6,12.95 28.89,12.95 28.89,13.02 44.39,13.02 44.39,-13.97 55.56,-25.15 -2.6,-25.15 -2.86,-24.89 -2.86,12.7
MISO  (via drill 0.35)
  Top 0.203: U4.14 15.22,4.87 v15.1,4.75 | U1.14 14.36,8.37 v14.58,8.15
  Bottom 0.203: v14.58,8.15 15.28,7.45 15.28,5.32 15.1,5.14 v15.1,4.75 17.9,4.75 20.34,2.31 21.03,2.31 21.39,1.95 22.15,1.95 22.96,1.14 TP6.TP
MOSI  (via drill 0.35)
  Top 0.203: U1.13 | U1.13 13.89,7.87 v14.6,7.17 | U4.13 16.77,5.35 15.46,5.35 15.38,5.43 14.7,5.43 v14.56,5.57
  Bottom 0.203: v14.6,7.17 14.6,5.6 v14.56,5.57 14.56,5.18 14.41,5.03 14.41,4.46 14.81,4.06 18,4.06 20.29,1.78 | 20.38,1.78 20.29,1.78 | 20.38,1.78 20.99,1.78 21.53,1.24 TP5.TP | 20.29,1.78 20.38,1.78
N$1
  Top 0.203: U4.7 17.45,9.76 17.97,10.29 R12.2
N$2
  Top 0.203: L1.2 L3.1 | 9.15,11.53 L1.2 | U1.22 9.33,10.14 9.33,11.05 9.09,11.3 L1.2
N$3
  Top 0.203: 10.1,11.57 L2.1 | 10.1,11.57 L1.1 9.81,11.31 U1.21 | 10.1,11.57 10.1,11.5
N$4
  Top 0.203: C3.1 L2.2 10.71,12.33 10.71,11.17 10.31,10.78 U1.20
N$5
  Top 0.203: L4.2 4.11,4.2 L5.1
N$6
  Top 0.203: C5.2 L3.2
N$7
  Top 0.203: U1.3 9.31,2.55 C11.1
N$8
  Top 0.203: U1.2 8.81,3.44 C10.1
N$9
  Top 0.203: Y2.3 1.57,9.7 1.04,9.7 0.86,9.52 0.86,7.82 1.04,7.64 2.89,7.64 3.13,7.87 U1.28
N$10
  Top 0.203: U1.27 2.15,8.37 Y2.1
N$11
  Top 0.203: U1.32 6.19,5.87 L4.1
N$12
  Top 0.203: U1.25 6.14,9.37 R1.1
N$13
  Top 0.203: C5.1 C6.2 4.2,11.55 U$28.FEED 4.2,12.29 C15.2
N$14
  Top 0.203: U4.8 16.8,11.34 R13.2
N$15
  Top 0.203: R13.1 LED1.A
N$16
  Top 0.203: R12.1 LED2.A
N$18
  Top 0.203: U4.17 18.35,2.8 C1.1
N$22
  Top 0.203: U1.4 9.81,2.95 C14.2 | 10.6,2.16 C14.2 | C14.2 10.82,2.29 CRYSTAL1.2
N$23
  Top 0.203: C13.2 14.01,1.4 CRYSTAL1.1 12.26,1.94 12.26,2.02 12.08,2.2 11.6,2.2 10.31,3.49 U1.5
NRFRESET
  Top 0.203: U4.11 16.15,6.22 15.94,6.43 15.94,9.12 14.95,10.11 13.53,10.11 13.23,10.4 13.23,11.14 12.64,11.73 11.97,11.73 11.57,11.33 11.57,11.32 11.28,11.02 11.26,11.02 10.88,10.65 10.88,10.19 U1.19
RDYN  (via drill 0.35)
  Top 0.203: U1.16 13.45,9.37 13.77,9.7 14.39,9.7 v15.26,8.83 | U4.28 21.73,7.57 v21.78,7.62
  Bottom 0.203: v15.26,8.83 15.26,8.44 16.14,7.56 21.72,7.56 v21.78,7.62
REQN
  Top 0.203: U4.12 16.77,5.8 16,5.8 15.31,6.49 14.31,6.49 13.43,7.37 U1.12
RST  (via drill 0.35)
  Top 0.203: U4.25 20.82,6.25 21.3,6.25 21.51,6.46 21.51,6.94 22.3,6.94 C22.1 | C22.1 R10.1 | C22.1 23.46,7.27 23.46,7.26 23.64,7.08 24.49,7.08 24.65,7.24 TP3.TP
  other vias: 25.59,7.24
SCK  (via drill 0.35)
  Top 0.203: U4.15 15.54,4.22 15.38,4.06 14.81,4.06 14.66,4.22 14,4.22 v13.53,4.7 13.27,4.95 13.27,6.62 13.09,6.8 12.63,6.8 U1.11
  Bottom 0.203: v13.53,4.7 13.6,4.7 14.65,3.66 17.84,3.66 19.24,2.25 TP4.TP
SCL  (via drill 0.35)
  Top 0.203: U4.24 21.7,5.77 21.99,6.07 22.51,6.07 v22.8,6.35 | U5.4 22.2,4.1 v22.54,4.44 | v25.72,6.1 25.59,5.97 R9.1 25.59,4.8 25.8,4.59 25.8,4.16 U6.6
  Bottom 0.203: v22.54,4.44 22.54,6.1 v22.8,6.35 23.26,5.89 23.26,3.89 23.66,3.49 24.22,3.49 24.62,3.89 24.62,4.84 25.72,5.94 v25.72,6.1
SDA  (via drill 0.35)
  Top 0.203: U5.3 22.03,3.03 21.9,3.03 21.72,3.21 21.72,3.34 21.38,3.68 v21.38,4.04 21.38,4.53 21.51,4.66 21.51,5.08 21.3,5.3 20.82,5.3 U4.23 20.82,5.35 21.85,5.35 21.96,5.46 R8.1 | 26.34,4.31 U6.5 26.41,4.19 26.41,4.86 v26.45,4.9
  Bottom 0.203: v21.38,4.04 21.51,3.91 21.51,2.4 22.46,2.4 22.92,1.94 22.93,1.95 24.18,1.95 24.35,1.78 26.35,1.78 26.74,2.16 26.74,4.19 26.73,4.19 26.73,4.7 26.53,4.9 v26.45,4.9
SDO  (via drill 0.35)
  Top 0.203: U5.5 23.65,3.88 v23.94,4.17 | U4.1 20.78,8.22 v21.15,8.59
  Bottom 0.203: v21.15,8.59 21.43,8.3 22.06,8.3 23.94,6.43 v23.94,4.17
VDD  (via drill 0.35)
  Top 0.203: 8.31,4.95 U1.1 | 8.31,4.95 8.31,3.81 8.19,3.68 7.31,3.68 6.7,3.07 6.69,3.07 6.54,2.92 6.54,2.54 6.41,2.41 | 6.41,2.41 C9.1 | 15.56,2.29 C24.1 | 6.29,2.54 6.41,2.41 | U4.3 v19.25,9.26 v19.24,9.27 | U1.9 v12.56,5.08 12.84,4.8 12.84,4.42 12.85,4.41 | FB1.1 2.29,5.91 v1.59,5.21 | v7.43,5.08 8.19,5.08 8.31,4.95 | 12.85,4.41 13.6,3.66 15.2,3.66 15.56,3.3 15.56,2.29 | R9.2 R8.2 | R9.2 24.57,6.3 v24.62,6.35 | R10.2 24.47,8.76 v24.72,9.02 | U4.16 17.87,4.2 17.87,3.72 17.72,3.57 C16.1 C23.1 15.56,2.29 | U5.8 23.82,1.74 23.95,1.74 24.13,1.91 24.13,2.52 23.95,2.69 23.82,2.69 U5.6 23.82,3.03 23.95,3.03 24.09,3.17 24.45,3.17 24.45,3.72 24.62,3.89 24.62,3.9 U6.8 24.62,4.34 24.62,4.46 24.57,4.5 R9.2 | v25.46,11.18 25.46,12.19 TP1.TP | C12.1 12.27,3.38 12.27,3.4 12.85,3.98 12.85,4.41
  Bottom 0.203: v19.24,9.27 23.45,9.27 24.46,10.28 | 24.46,10.28 BAT1.1 | 25.72,9.02 24.46,10.28 | BAT1.1 v24.72,9.02 24.72,6.45 v24.62,6.35 | BAT1.1 22.38,12.88 12.3,12.88 12.25,12.83 3.37,12.83 1.82,11.28 BAT1.3 1.59,10.31 v1.59,5.21 7.3,5.21 v7.43,5.08 8.57,3.94 12.38,3.94 12.56,4.12 v12.56,5.08 | BAT1.1 24.83,10.54 v25.46,11.18
XTAL1
  Top 0.203: U4.5 18.37,8.25 18.37,9.37 18.96,9.95 19.52,9.95 19.78,9.7 24.47,9.7 24.47,10.76 23.8,11.43 Y1.1
XTAL2
  Top 0.203: U4.6 17.92,8.25 17.92,9.49 18.79,10.36 19.46,10.36 20.53,11.43 Y1.3

### Text on the board
tPlace: Austin Martratt | LED1 | LED2 | VCC | GND
bPlace: V1.0 | RST | MOSI | SCK | MISO